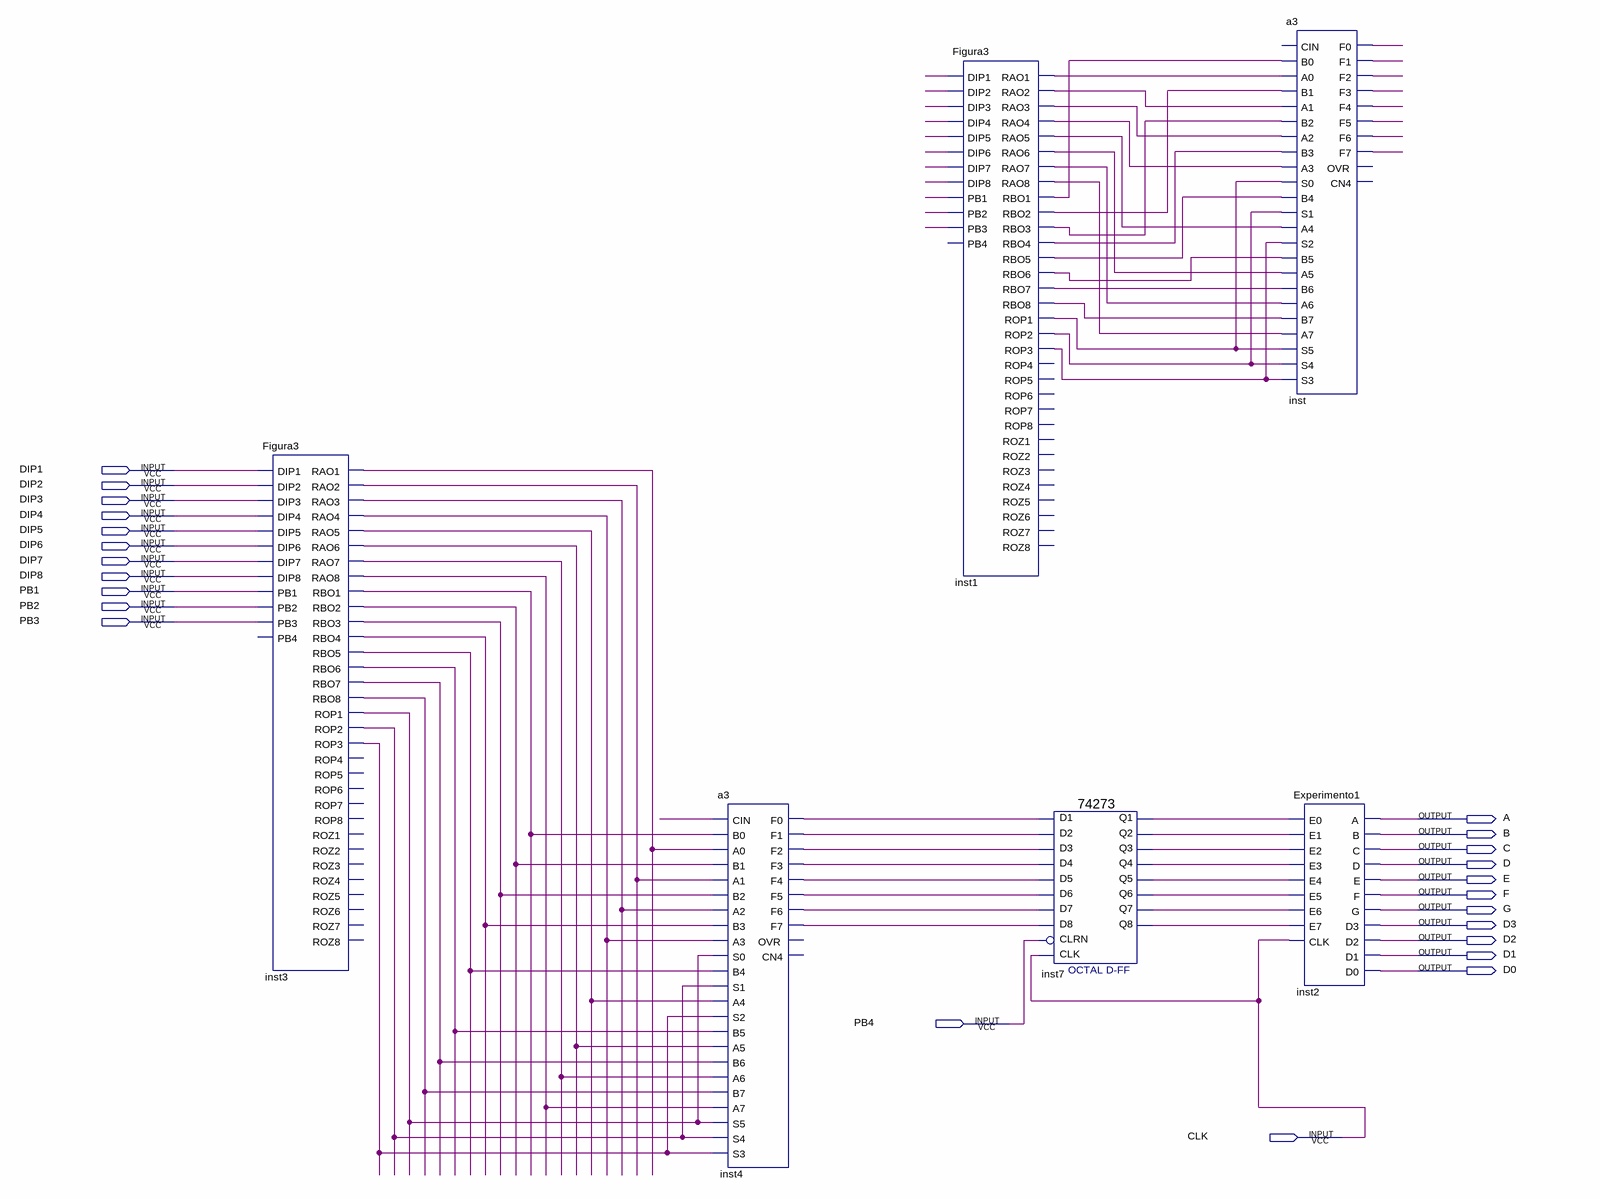
[diagram p0: schematic sheet]
// Quartus schematic experimento2.bdf as structural Verilog: 6 symbols, 24 pins
module experimento2 (
  input  DIP1,
  input  DIP2,
  input  DIP3,
  input  DIP4,
  input  DIP5,
  input  DIP6,
  input  DIP7,
  input  DIP8,
  input  PB1,
  input  PB2,
  input  PB3,
  input  PB4,
  input  CLK,
  output A,
  output B,
  output C,
  output D,
  output E,
  output F,
  output G,
  output D3,
  output D2,
  output D1,
  output D0
);

  wire inst1_rao1, inst1_rao2, inst1_rao3, inst1_rao4, inst1_rao5, inst1_rao6, inst1_rao7, inst1_rao8,
       inst1_rbo1, inst1_rbo2, inst1_rbo3, inst1_rbo4, inst1_rbo5, inst1_rbo6, inst1_rbo7, inst1_rbo8,
       inst1_rop1, inst1_rop2, inst1_rop3, inst3_rao1, inst3_rao2, inst3_rao3, inst3_rao4, inst3_rao5,
       inst3_rao6, inst3_rao7, inst3_rao8, inst3_rbo1, inst3_rbo2, inst3_rbo3, inst3_rbo4, inst3_rbo5,
       inst3_rbo6, inst3_rbo7, inst3_rbo8, inst3_rop1, inst3_rop2, inst3_rop3, inst4_f0, inst4_f1, inst4_f2,
       inst4_f3, inst4_f4, inst4_f5, inst4_f6, inst4_f7, inst7_q1, inst7_q2, inst7_q3, inst7_q4, inst7_q5,
       inst7_q6, inst7_q7, inst7_q8, inst_f0, inst_f1, inst_f2, inst_f3, inst_f4, inst_f5, inst_f6, inst_f7,
       undriven, undriven_2, undriven_3, undriven_4, undriven_5, undriven_6, undriven_7, undriven_8,
       undriven_9, undriven_10, undriven_11, undriven_12;

  Figura3 inst3 (
    .DIP1(DIP1), .DIP2(DIP2), .DIP3(DIP3), .DIP4(DIP4), .DIP5(DIP5), .DIP6(DIP6), .DIP7(DIP7), .DIP8(DIP8),
    .PB1(PB1), .PB2(PB2), .PB3(PB3), .RAO1(inst3_rao1), .RAO2(inst3_rao2), .RAO3(inst3_rao3),
    .RAO4(inst3_rao4), .RAO5(inst3_rao5), .RAO6(inst3_rao6), .RAO7(inst3_rao7), .RAO8(inst3_rao8),
    .RBO1(inst3_rbo1), .RBO2(inst3_rbo2), .RBO3(inst3_rbo3), .RBO4(inst3_rbo4), .RBO5(inst3_rbo5),
    .RBO6(inst3_rbo6), .RBO7(inst3_rbo7), .RBO8(inst3_rbo8), .ROP1(inst3_rop1), .ROP2(inst3_rop2),
    .ROP3(inst3_rop3));  // open: PB4, ROP4, ROP5, ROP6, ROP7, ROP8, ROZ1, ROZ2, ROZ3, ROZ4, ROZ5, ROZ6, ROZ7, ROZ8
  a3 inst4 (
    .CIN(undriven_12), .B0(inst3_rbo1), .A0(inst3_rao1), .B1(inst3_rbo2), .A1(inst3_rao2), .B2(inst3_rbo3),
    .A2(inst3_rao3), .B3(inst3_rbo4), .A3(inst3_rao4), .S0(inst3_rop1), .B4(inst3_rbo5), .S1(inst3_rop2),
    .A4(inst3_rao5), .S2(inst3_rop3), .B5(inst3_rbo6), .A5(inst3_rao6), .B6(inst3_rbo7), .A6(inst3_rao7),
    .B7(inst3_rbo8), .A7(inst3_rao8), .S5(inst3_rop1), .S4(inst3_rop2), .S3(inst3_rop3), .F0(inst4_f0),
    .F1(inst4_f1), .F2(inst4_f2), .F3(inst4_f3), .F4(inst4_f4), .F5(inst4_f5), .F6(inst4_f6), .F7(inst4_f7));  // open: OVR, CN4
  Figura3 inst1 (
    .DIP1(undriven), .DIP2(undriven_2), .DIP3(undriven_3), .DIP4(undriven_4), .DIP5(undriven_5),
    .DIP6(undriven_6), .DIP7(undriven_7), .DIP8(undriven_8), .PB1(undriven_9), .PB2(undriven_10),
    .PB3(undriven_11), .RAO1(inst1_rao1), .RAO2(inst1_rao2), .RAO3(inst1_rao3), .RAO4(inst1_rao4),
    .RAO5(inst1_rao5), .RAO6(inst1_rao6), .RAO7(inst1_rao7), .RAO8(inst1_rao8), .RBO1(inst1_rbo1),
    .RBO2(inst1_rbo2), .RBO3(inst1_rbo3), .RBO4(inst1_rbo4), .RBO5(inst1_rbo5), .RBO6(inst1_rbo6),
    .RBO7(inst1_rbo7), .RBO8(inst1_rbo8), .ROP1(inst1_rop1), .ROP2(inst1_rop2), .ROP3(inst1_rop3));  // open: PB4, ROP4, ROP5, ROP6, ROP7, ROP8, ROZ1, ROZ2, ROZ3, ROZ4, ROZ5, ROZ6, ROZ7, ROZ8
  \74273  inst7 (
    .D2(inst4_f1), .D3(inst4_f2), .D1(inst4_f0), .D4(inst4_f3), .D7(inst4_f6), .D6(inst4_f5), .D5(inst4_f4),
    .D8(inst4_f7), .CLK(CLK), .CLRN(PB4), .Q4(inst7_q4), .Q1(inst7_q1), .Q2(inst7_q2), .Q3(inst7_q3),
    .Q6(inst7_q6), .Q5(inst7_q5), .Q7(inst7_q7), .Q8(inst7_q8));
  a3 inst (
    .B0(inst1_rbo1), .A0(inst1_rao1), .B1(inst1_rbo2), .A1(inst1_rao2), .B2(inst1_rbo3), .A2(inst1_rao3),
    .B3(inst1_rbo4), .A3(inst1_rao4), .S0(inst1_rop1), .B4(inst1_rbo5), .S1(inst1_rop2), .A4(inst1_rao5),
    .S2(inst1_rop3), .B5(inst1_rbo6), .A5(inst1_rao6), .B6(inst1_rbo7), .A6(inst1_rao7), .B7(inst1_rbo8),
    .A7(inst1_rao8), .S5(inst1_rop1), .S4(inst1_rop2), .S3(inst1_rop3), .F0(inst_f0), .F1(inst_f1),
    .F2(inst_f2), .F3(inst_f3), .F4(inst_f4), .F5(inst_f5), .F6(inst_f6), .F7(inst_f7));  // open: CIN, OVR, CN4
  Experimento1 inst2 (
    .E0(inst7_q1), .E1(inst7_q2), .E2(inst7_q3), .E3(inst7_q4), .E4(inst7_q5), .E5(inst7_q6), .E6(inst7_q7),
    .E7(inst7_q8), .CLK(CLK), .A(A), .B(B), .C(C), .D(D), .E(E), .F(F), .G(G), .D3(D3), .D2(D2), .D1(D1),
    .D0(D0));
endmodule
